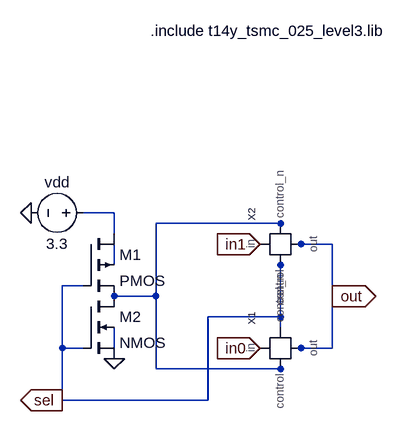
[diagram p0: schematic t_mux.asc]
t_mux.asc, the LTspice schematic file:
Version 4
SHEET 1 880 680
WIRE -32 80 -80 80
WIRE 224 96 32 96
WIRE -32 112 -32 80
WIRE 224 112 224 96
WIRE 208 128 192 128
WIRE 256 128 240 128
WIRE 304 128 256 128
WIRE -32 160 -32 128
WIRE 224 160 224 144
WIRE -80 192 -112 192
WIRE 32 208 32 96
WIRE 32 208 -32 208
WIRE 304 208 304 128
WIRE 224 240 224 160
WIRE 224 240 112 240
WIRE 224 256 224 240
WIRE -112 288 -112 192
WIRE -80 288 -112 288
WIRE -32 288 -32 256
WIRE 208 288 192 288
WIRE 256 288 240 288
WIRE 304 288 304 208
WIRE 304 288 256 288
WIRE 32 320 32 208
WIRE 224 320 224 304
WIRE 224 320 32 320
WIRE -112 368 -112 288
WIRE 112 368 112 240
WIRE 112 368 -112 368
FLAG -160 80 0
FLAG -32 304 0
FLAG 192 128 in1
IOPIN 192 128 In
FLAG 192 288 in0
IOPIN 192 288 In
FLAG 304 208 out
IOPIN 304 208 Out
FLAG -112 368 sel
IOPIN -112 368 Out
SYMBOL pmos4 -80 112 R0
SYMATTR InstName M1
SYMATTR Value2 l=250n w=40u m=200
SYMBOL nmos4 -80 208 R0
SYMATTR InstName M2
SYMATTR Value2 l=250n w=20u m=200
SYMBOL voltage -64 80 R90
WINDOW 0 -32 56 VBottom 2
WINDOW 3 32 56 VTop 2
WINDOW 123 0 0 Left 0
WINDOW 39 0 0 Left 0
SYMATTR InstName vdd
SYMATTR Value 3.3
SYMBOL tg_gate 224 288 R270
SYMATTR InstName X1
SYMBOL tg_gate 224 128 R270
SYMATTR InstName X2
TEXT 24 -200 Left 2 !.include t14y_tsmc_025_level3.lib

The netlist it stands for:
* t_mux.asc
M1 N001 sel N002 N003 PMOS l=250n w=40u m=200
M2 N002 sel 0 N004 NMOS l=250n w=20u m=200
vdd N001 0 3.3
XX1 in0 out N002 sel tg_gate  ; pins in out control control_n
XX2 in1 out sel N002 tg_gate  ; pins in out control control_n
.model NMOS NMOS
.model PMOS PMOS
.lib standard.mos
.include t14y_tsmc_025_level3.lib
.backanno
.end